# EAGLE design Tikkenteller (EAGLE 7.2.0)
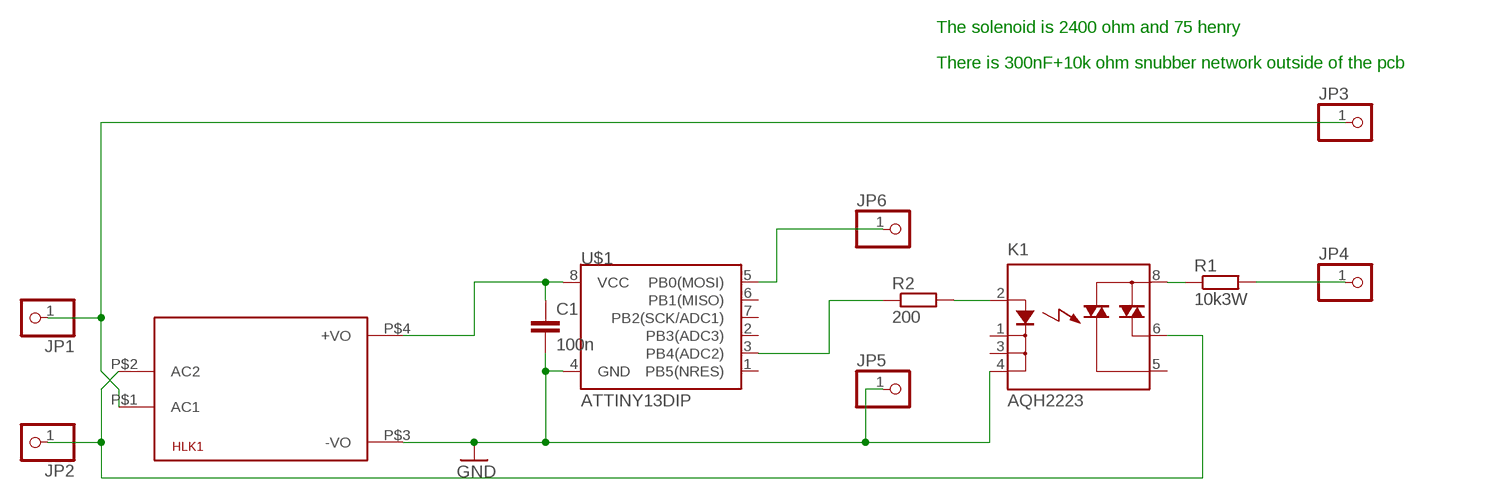
[diagram p0: schematic, sheet 1]

## Parts
C1  100n  C-EU050-024X044  [C050-024X044]
HLK1  HLK-PM013W  [HLK-PM01]
JP1  PINHD-1X1  [1X01]
JP2  PINHD-1X1  [1X01]
JP3  PINHD-1X1  [1X01]
JP4  PINHD-1X1  [1X01]
JP5  PINHD-1X1  [1X01]
JP6  PINHD-1X1  [1X01]
K1  AQH2223  [DIL07]
R1  10k3W  RR10  [RESISTOR10]
R2  200  RR4  [RESISTOR4]
U$1  ATTINY13DIP  [DIP08]

## Nets
GND: C1.2 HLK1.P$3(-VO) JP5.1 K1.4(K2) U$1.4(GND)
N$1: HLK1.P$2(AC2) JP2.1 K1.6(DS3)
N$2: HLK1.P$1(AC1) JP1.1 JP3.1
N$3: K1.8(DS1) R1.1
N$4: JP4.1 R1.2
N$5: K1.2(A) R2.2
N$6: R2.1 U$1.3(PB4(ADC2))
N$8: C1.1 HLK1.P$4(+VO) U$1.8(VCC)
N$9: JP6.1 U$1.5(PB0(MOSI))
Unconnected: K1.1(K) K1.3(K1) K1.5(DS2) U$1.1(PB5(NRES)) U$1.2(PB3(ADC3)) U$1.6(PB1(MISO)) U$1.7(PB2(SCK/ADC1))

## Notes on the sheet
- The solenoid is 2400 ohm and 75 henry
- There is 300nF+10k ohm snubber network outside of the pcb

## Library data of the parts
C1 = rcl:C-EU: CAPACITOR, European symbol
HLK1 = HLK-PM01:HLK-PM01: Hi-Link Power Supply HLK-PM01 3W Author: Ahmed Said <https://github.com/AhmedSaid/EAGLELibraries>
JP1-JP6 = adafruit:PINHD-1X1: Pin header 1x1 for 0.1" spacing With round pins
K1 = relay:AQH*223: SOLID STATE RELAY NAiS Source: http://www.mew-europe.com/.. en_ds_61613_0000.pdf; MF: AROMAT/ MATSUSHITA; MPN: AQH2223; OC_FARNELL: unknown; OC_NEWARK: 26K3059
R1 R2 = cvdo-resistor:R: cvdo-resistor
U$1 = SparkFun-DigitalIC:ATTINY13: Atmel 8-pin 1kB flash uC

## Board
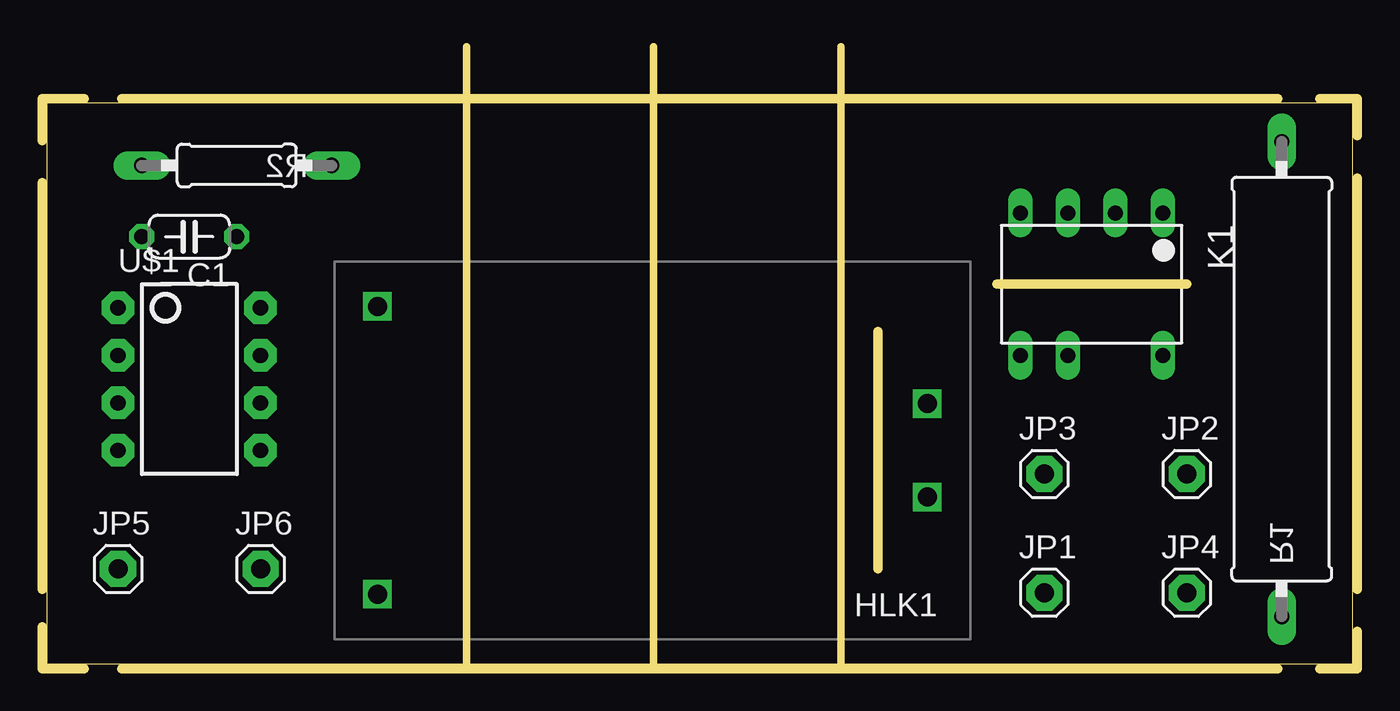
[diagram p1: board, top side]
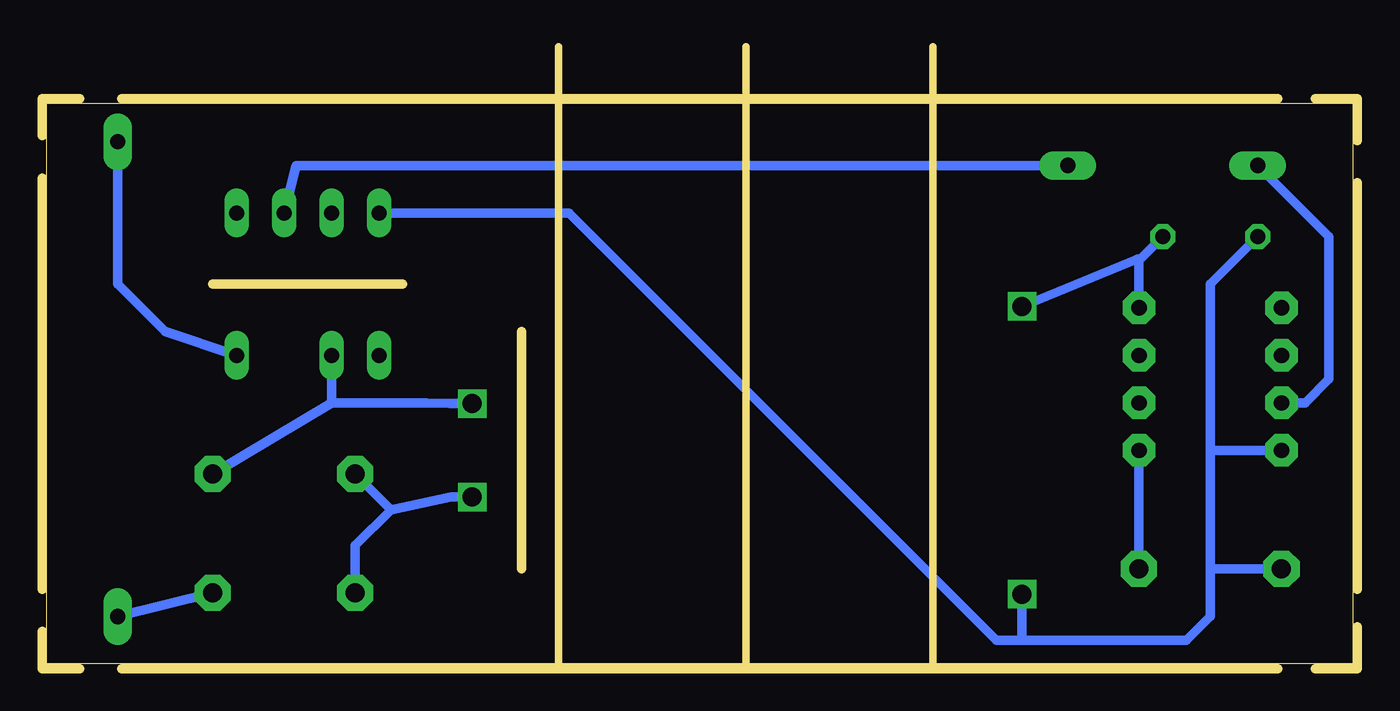
[diagram p2: board, bottom side, seen from below]

Size 69.84 x 33.02 mm. Coordinates in mm from the lower left corner, seen from the top.
Outline: 22.46,0 0,0 0,30 69.84,30 69.84,0 42.46,0
Outline: 22.46,0 32.46,0
Outline: 32.46,0 42.46,0
Outline: 32.46,0 32.46,33.02
Outline: 22.46,0 22.46,33.02
Outline: 42.46,0 42.46,33.02
Copper layers (1*16): Top 0.035mm / dielectric 1.5mm / Bottom 0.035mm
Design rules "default": minimum track width 10mil, minimum drill 24mil, track to track 8mil, track to pad 8mil, pad to pad 8mil, via to via 8mil, smd to smd 8mil, copper to edge 40mil, drill to drill 8mil, minimum pad ring 10mil, minimum via ring 8mil, stop-mask expansion 4mil, vias tented up to drill 0mil, thermal gap 10mil
Milling: 14 lines

### Footprints (pad centres in the part's own frame; a part is rotated, then mirrored left to right if it is on the bottom)
C050-024X044 = drill 0.813 octagon: 1 -2.54,0; 2 2.54,0
HLK-PM01 = drill 1.016 square: P$1 -14.7,2.5; P$2 -14.7,-2.5; P$3 14.7,7.7; P$4 14.7,-7.7
1X01 = drill 1.016 pad 1.93 octagon: 1 0,0
DIL07 = drill 0.8 long: 1 -3.81,-3.81; 2 -1.27,-3.81; 3 1.27,-3.81; 4 3.81,-3.81; 5 3.81,3.81; 6 1.27,3.81; 8 -3.81,3.81
RESISTOR10 = drill 0.813 pad 1.524 long: 1 -12.7,0; 2 12.7,0
RESISTOR4 = drill 0.813 pad 1.524 long: 1 -5.08,0; 2 5.08,0
DIP08 = drill 0.813 pad 1.727 octagon: 1 -3.81,-3.81; 2 -1.27,-3.81; 3 1.27,-3.81; 4 3.81,-3.81; 5 3.81,3.81; 6 1.27,3.81; 7 -1.27,3.81; 8 -3.81,3.81

### Placement (x,y rotation side)
C1  7.62,22.86 180 top
HLK1  32.38,11.43 180 top
JP1  53.34,3.81 0 top
JP2  60.96,10.16 0 top
JP3  53.34,10.16 0 top
JP4  60.96,3.81 0 top
JP5  3.81,5.08 0 top
JP6  11.43,5.08 0 top
K1  55.88,20.32 180 top
R1  66.04,15.24 270 top
R2  10.16,26.67 0 top
U$1  7.62,15.24 270 top

### Tracks (layer width: path | path; a pad name or v marks a point on that pad's centre or on a via)
GND
  Bottom 0.5: C1.2 7.62,20.32 7.62,11.43 | 7.62,11.43 7.62,5.08 | 7.62,5.08 7.62,2.54 8.89,1.27 17.78,1.27 | 17.78,1.27 19.05,1.27 41.91,24.13 K1.4 | HLK1.P$3 17.69,1.36 17.78,1.27 | JP5.1 7.62,5.08 | U$1.4 7.62,11.43
N$1
  Bottom 0.5: K1.6 54.61,13.97 | 54.61,13.97 JP2.1 | HLK1.P$2 48.3,13.93 49.53,13.97 54.61,13.97
N$2
  Bottom 0.5: HLK1.P$1 48.22,8.93 51.44,8.26 | 51.44,8.26 53.34,6.35 JP1.1 | JP3.1 51.44,8.26
N$3
  Bottom 0.5: K1.8 63.5,17.78 66.04,20.32 R1.1
N$4
  Bottom 0.5: JP4.1 R1.2
N$5
  Bottom 0.5: R2.2 56.52,26.67 K1.2
N$6
  Bottom 0.5: U$1.3 2.54,13.97 1.27,15.24 1.27,22.86 R2.1
N$8
  Bottom 0.5: HLK1.P$4 11.51,21.67 11.43,21.59 | 11.43,21.59 C1.1 | U$1.8 11.43,21.59
N$9
  Bottom 0.5: U$1.5 JP6.1